# Altium schematic sheet power-supplies-hw.SchDoc
size A3; SheetNumber: 9; SheetTotal: 10
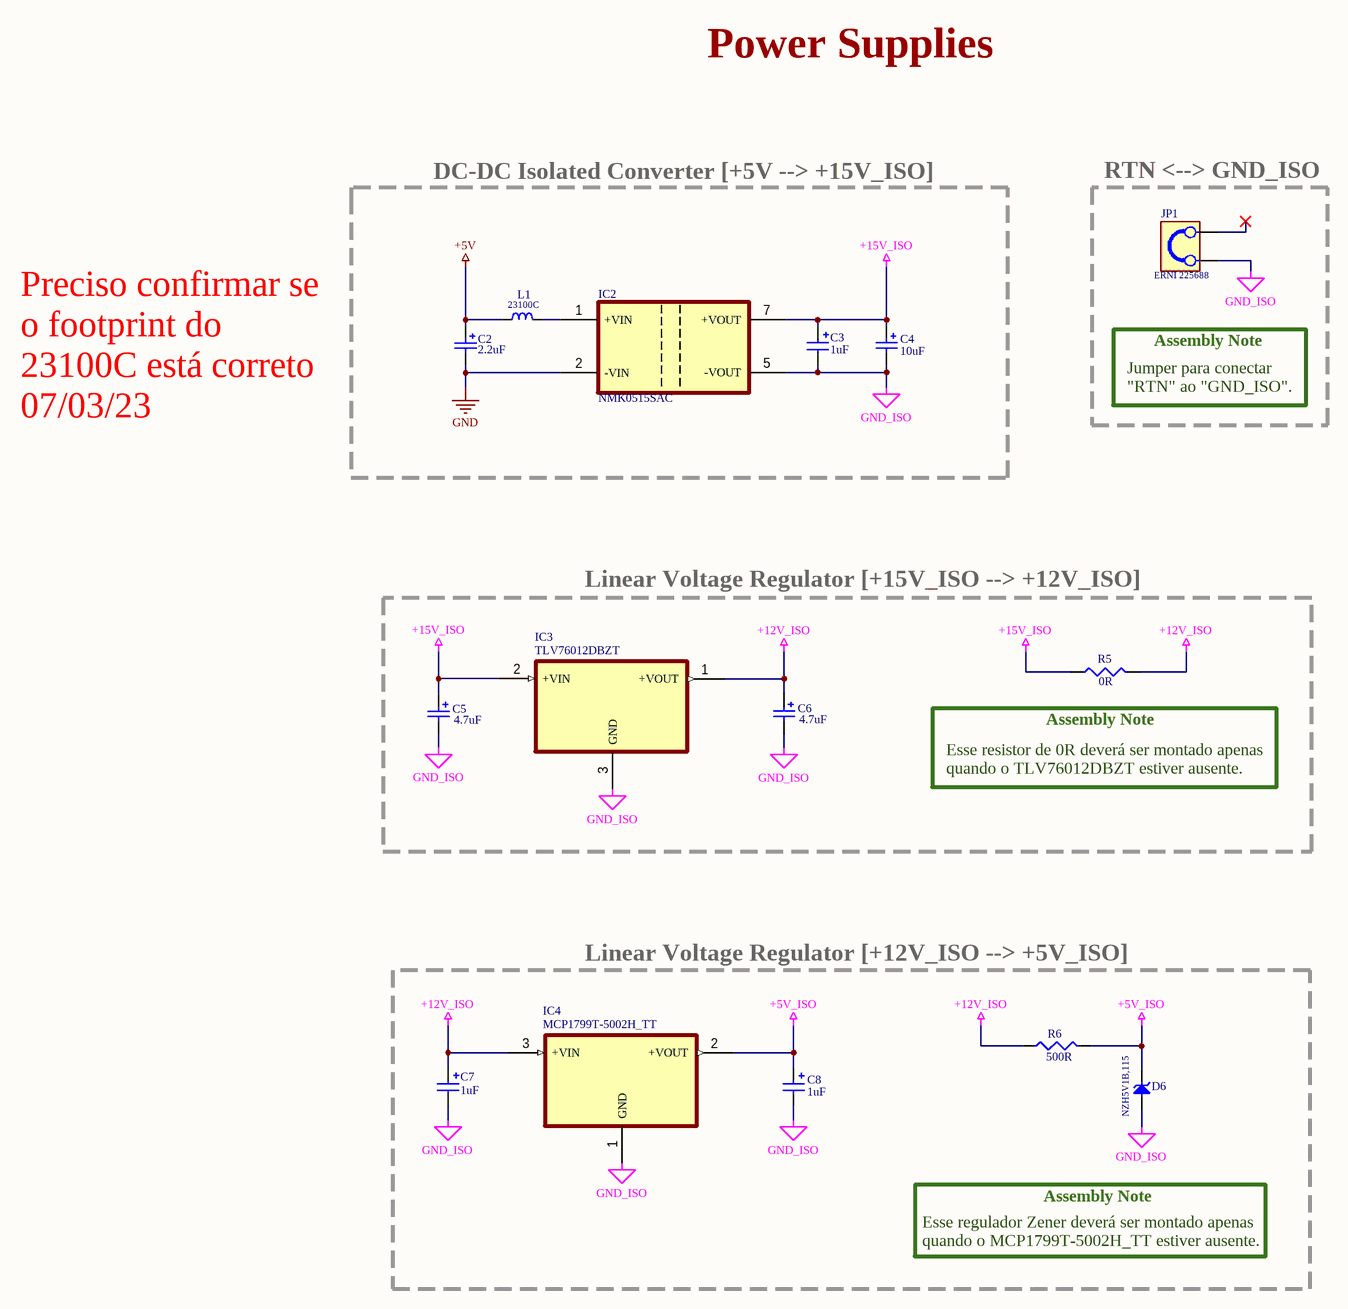
[diagram p0: power-supplies-hw.SchDoc]

## Parts
C2  2.2uF  [C1206]
C3  1uF  [C1206]
C4  10uF  [C1206]
C5  4.7uF  [C1206]
C6  4.7uF  [C1206]
C7  1uF  [C1206]
C8  1uF  [C1206]
D6  NZH5V1B,115  [SOD-123F-2]
IC2  NMK0515SAC  [NMK0515SAC]
IC3  TLV76012DBZT  [SOT_23_3]
IC4  MCP1799T-5002H_TT  [SOT_23_3]
JP1  ERNI 225688  [ERNI 225688]
L1  23100C  [23100C]
R5  0R  [R1210]
R6  500R  [Resistor 0805]

## Blocks framed on the sheet
DC-DC Isolated Converter [+5V --> +15V_ISO]: C2-C4 IC2 L1
RTN <--> GND_ISO: JP1
Linear Voltage Regulator [+15V_ISO --> +12V_ISO]: C5 C6 IC3 R5
Linear Voltage Regulator [+12V_ISO --> +5V_ISO]: C7 C8 D6 IC4 R6

## Nets
+5V: C2.1 L1.1
+5V_ISO: C8.1 D6.1 IC4.2(+VOUT) R6.2
+12V_ISO: C6.1 C7.1 IC3.1(+VOUT) IC4.3(+VIN) R5.2 R6.1
+15V_ISO: C3.1 C4.1 C5.1 IC2.7(+VOUT) IC3.2(+VIN) R5.1
GND: C2.2 IC2.2(-VIN)
GND_ISO: C3.2 C4.2 C5.2 C6.2 C7.2 C8.2 D6.2 IC2.5(-VOUT) IC3.3(GND) IC4.1(GND) JP1.1
NetIC2_1: IC2.1(+VIN) L1.2

Not connected (* = marked no-connect by the designer): JP1 2*

## Notes on the sheet
- Power Supplies
- Assembly Note
- Jumper para conectar "RTN" ao "GND_ISO".
- Preciso confirmar se o footprint do 23100C está correto 07/03/23
- (near R5) Assembly Note
- Esse resistor de 0R deverá ser montado apenas quando o TLV76012DBZT estiver ausente.
- Esse regulador Zener deverá ser montado apenas quando o MCP1799T-5002H_TT estiver ausente.
- Title:
- Date:
- Project:
- Drawn by:
- Time:
- Revision:
- Sheet
- of
- ENT - AIS - SEI
  Sistemas Eletrônicos e
  Instrumentação
- Copyright CNPEM 2023.
  This documentation describes Open Hardware and is licensed under the CERN OHL S v2. You may redistribute and modify this documentation under the terms of the CERN OHL S v2. (https://www.ohwr.org/cernohl). This documentation is distributed WITHOUT ANY EXPRESS OR IMPLIED WARRANTY, INCLUDING OF MERCHANTABILITY, SATISFACTORY QUALITY AND FITNESS FOR A PARTICULAR PURPOSE. Please see the CERN OHL S v2 for applicable conditions.
- File:

## Library data of the parts
C2 = Capacitor 2.2uF
C3 C7 C8 = Capacitor 1uF
C4 = Capacitor 10uF
C5 C6 = Capacitor 4.7uF
D6 = Zener NZH5V1B,115: 5.1V, SOD-123F-2
IC2 = NMK0515SAC: 3kVDC Isolated 2W Single Output DC-DC Converter
IC3 = TLV76012DBZT: Linear-Voltage Regulator, +12V Fixed-Output, 100mA
IC4 = MCP1799T-5002H_TT: High-Voltage Automotive LDO, 80mA
L1 = 23100C: Bobbin Wound Surface Mount Inductors, 10uH, 138mOhms, Imax 1.02A
R5 = Resistor 0R: Size 1210
R6 = Resistor 500R